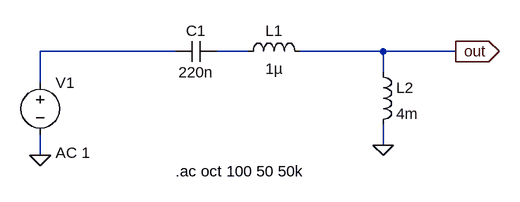
[diagram p0: schematic AC_interface_from_line_to_comm.asc]
AC_interface_from_line_to_comm.asc, the LTspice schematic file:
Version 4
SHEET 1 880 680
WIRE -64 112 -272 112
WIRE 48 112 0 112
WIRE 256 112 128 112
WIRE 368 112 256 112
WIRE 256 144 256 112
WIRE -272 160 -272 112
WIRE 256 256 256 224
WIRE -272 272 -272 240
FLAG 256 256 0
FLAG -272 272 0
FLAG 368 112 out
IOPIN 368 112 Out
SYMBOL cap 0 96 R90
WINDOW 0 0 32 VBottom 2
WINDOW 3 32 32 VTop 2
SYMATTR InstName C1
SYMATTR Value 220n
SYMBOL ind 32 128 R270
WINDOW 0 32 56 VTop 2
WINDOW 3 5 56 VBottom 2
SYMATTR InstName L1
SYMATTR Value 1µ
SYMBOL ind 240 128 R0
SYMATTR InstName L2
SYMATTR Value 4m
SYMBOL voltage -272 144 R0
WINDOW 3 24 152 Left 2
WINDOW 123 24 124 Left 2
WINDOW 39 0 0 Left 2
SYMATTR Value ""
SYMATTR Value2 AC 1
SYMATTR InstName V1
TEXT -64 296 Left 2 !.ac oct 100 50 50k

The netlist it stands for:
* AC_interface_from_line_to_comm.asc
C1 N002 N001 220n
L1 N002 out 1µ
L2 out 0 4m
V1 N001 0 AC 1
.ac oct 100 50 50k
.backanno
.end